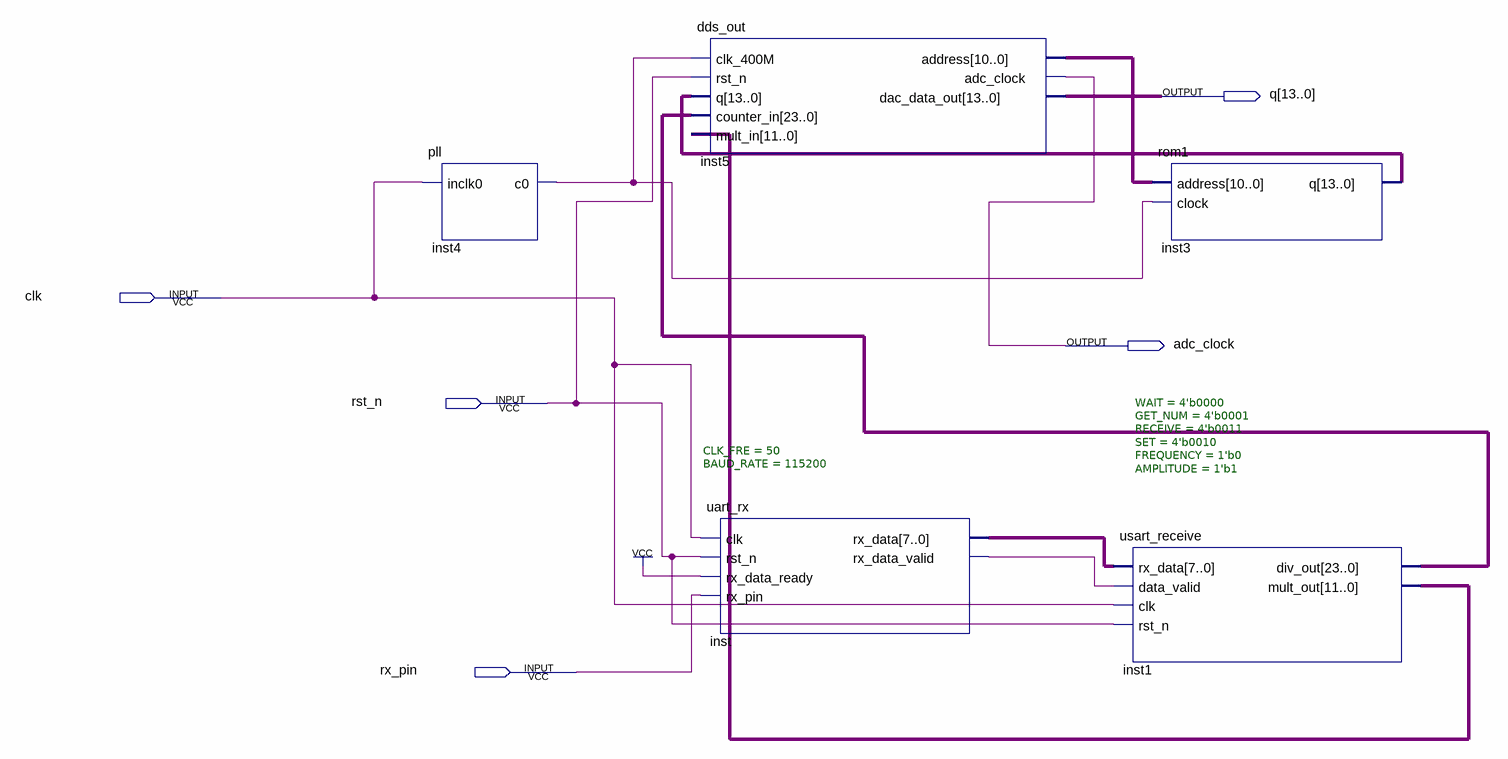
[diagram p0: schematic sheet]
// Quartus schematic dds_test.bdf as structural Verilog: 5 symbols, 5 pins
module dds_test (
  input  clk,
  input  rst_n,
  input  rx_pin,
  output [13:0] q,
  output adc_clock
);

  wire inst4_c0, inst_rx_data_valid;
  wire [7:0] inst_rx_data;
  wire [10:0] inst5_address;
  wire [11:0] inst1_mult_out;
  wire [13:0] inst3_q;
  wire [23:0] inst1_div_out;

  pll inst4 (.inclk0(clk), .c0(inst4_c0));
  dds_out inst5 (
    .clk_400M(inst4_c0), .rst_n(rst_n), .q(inst3_q), .counter_in(inst1_div_out), .mult_in(inst1_mult_out),
    .address(inst5_address), .adc_clock(adc_clock), .dac_data_out(q));
  uart_rx #(.CLK_FRE(50), .BAUD_RATE(115200)) inst (
    .clk(clk), .rst_n(rst_n), .rx_data_ready(1'b1), .rx_pin(rx_pin), .rx_data(inst_rx_data),
    .rx_data_valid(inst_rx_data_valid));
  usart_receive #(.WAIT(4'b0000), .GET_NUM(4'b0001), .RECEIVE(4'b0011), .SET(4'b0010), .FREQUENCY(1'b0), .AMPLITUDE(1'b1)) inst1 (
    .rx_data(inst_rx_data), .data_valid(inst_rx_data_valid), .clk(clk), .rst_n(rst_n),
    .div_out(inst1_div_out), .mult_out(inst1_mult_out));
  rom1 inst3 (.address(inst5_address), .clock(inst4_c0), .q(inst3_q));
endmodule
